# EAGLE design Qwiic_Spectral_Sensor-AS7265x-BottomJig (EAGLE 9.2.1)
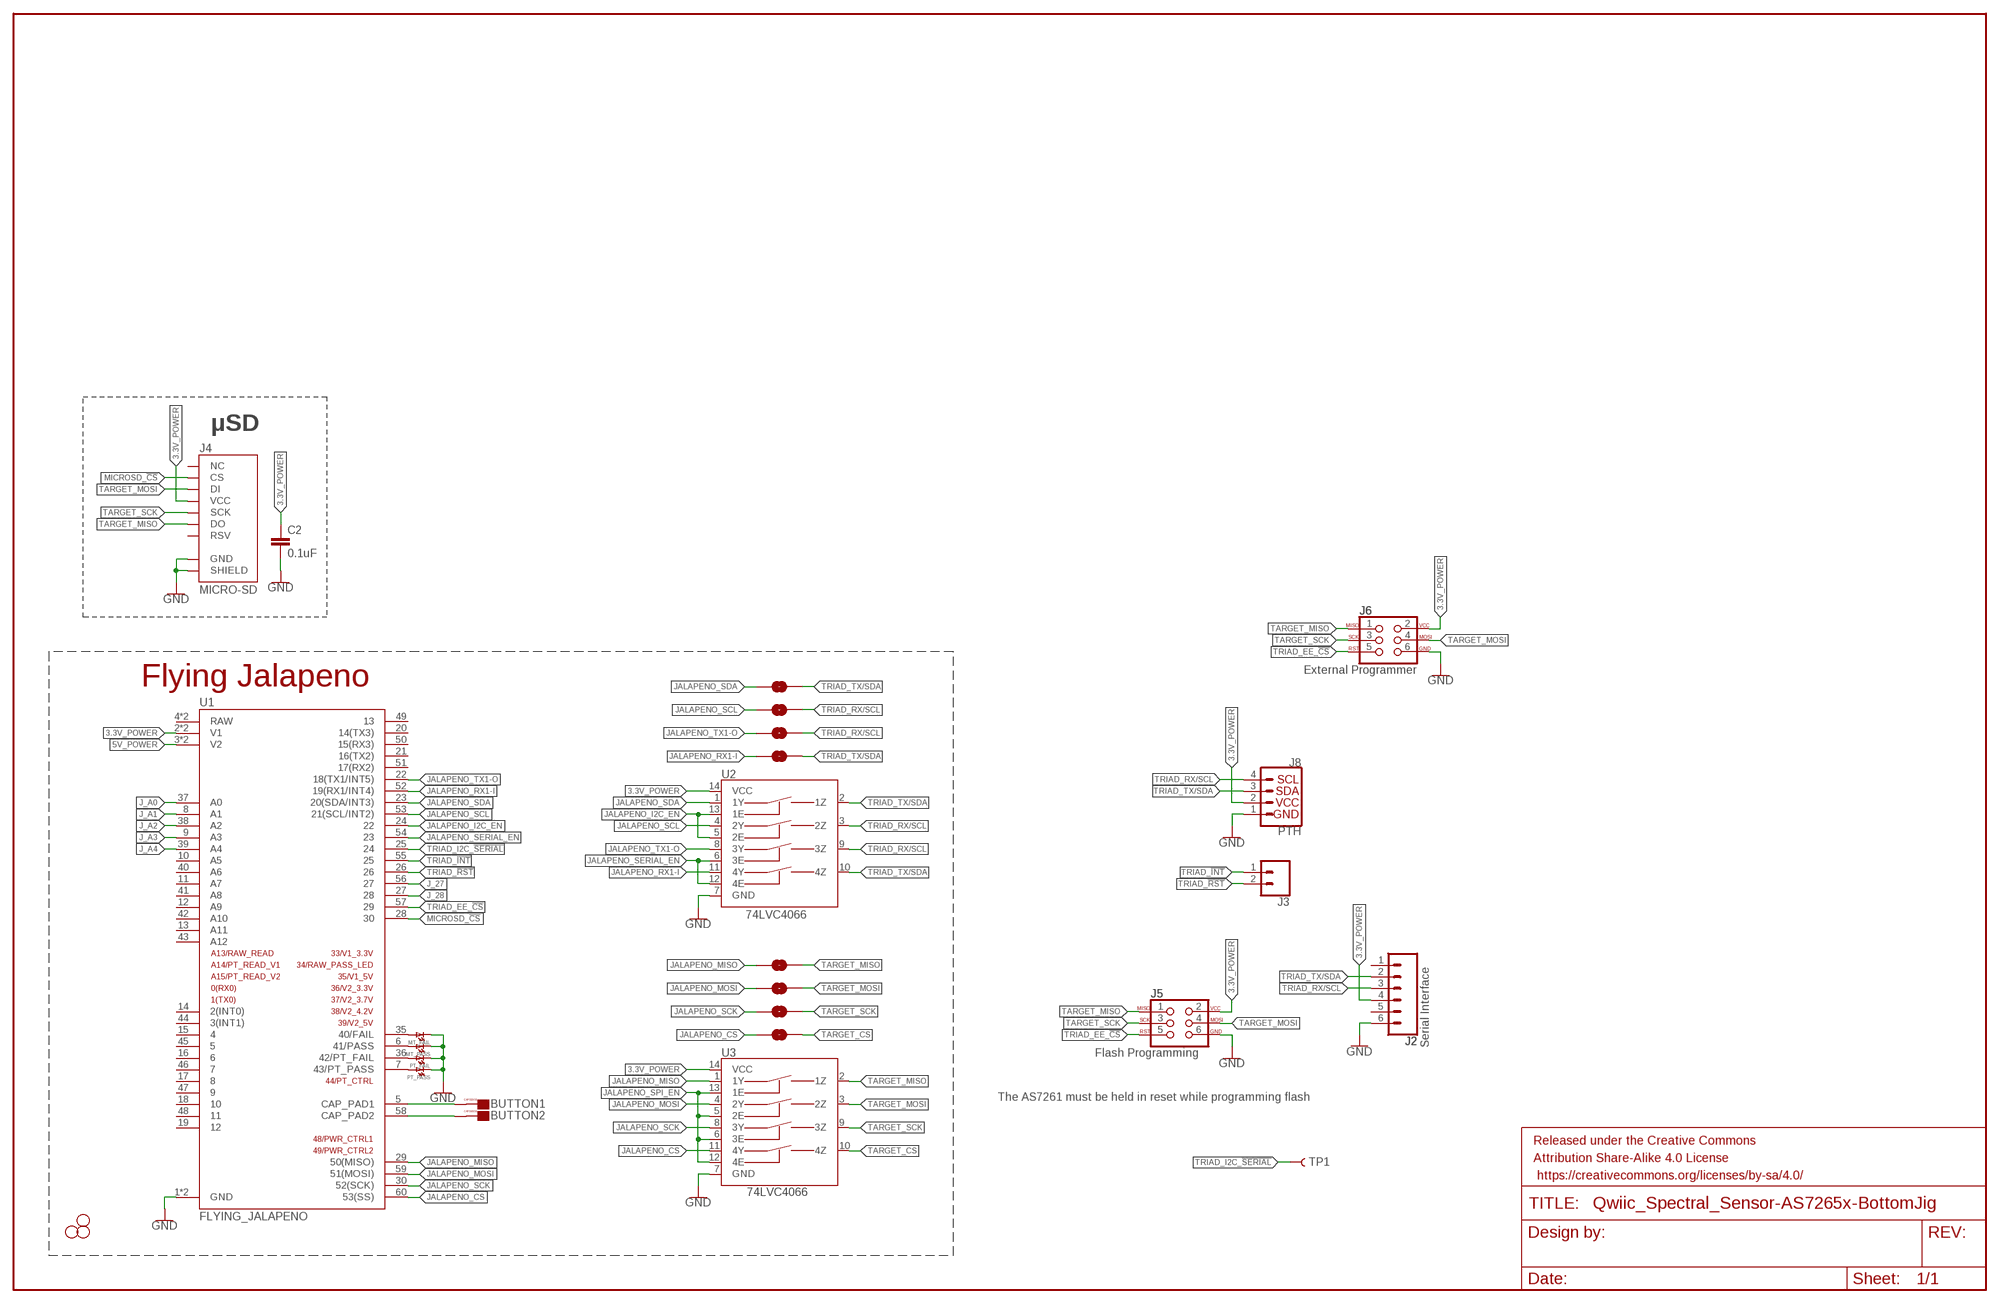
[diagram p0: schematic, sheet 1]

## Parts
BUTTON1  CAPSENSE_BUTTON_PAD_ONLY  [CAPSENSE_BUTTON_PADS_ONLY]
BUTTON2  CAPSENSE_BUTTON_PAD_ONLY  [CAPSENSE_BUTTON_PADS_ONLY]
C2  0.1uF  0.1UF-0603-25V-(+80/-20%)  [0603]
FRAME2  FRAME-LEDGER  [CREATIVE_COMMONS]
H1  STAND-OFF  [STAND-OFF]
H3  STAND-OFF  [STAND-OFF]
H4  STAND-OFF  [STAND-OFF]
J2  Serial Interface  CONN_06NO_SILK_FEMALE_PTH  [1X06_NO_SILK]
J3  CONN_021X02_NO_SILK  [1X02_NO_SILK]
J4  MICRO-SD  MICRO-SD_CARD_SOCKETPUSH-PUSH  [MICRO-SD-SOCKET]
J5  Flash Programming  AVR_SPI_PROG_3X2NS  [2X3-NS]
J6  External Programmer  AVR_SPI_PROG_3X2NS  [2X3-NS]
J8  PTH  I2C_STANDARD_NO_SILK  [1X04_NO_SILK]
J_SCL  JUMPER-SMT_2_NO_NO-SILK  [SMT-JUMPER_2_NO_NO-SILK]
J_SCL1  JUMPER-SMT_2_NO_NO-SILK  [SMT-JUMPER_2_NO_NO-SILK]
J_SCL2  JUMPER-SMT_2_NO_NO-SILK  [SMT-JUMPER_2_NO_NO-SILK]
J_SCL3  JUMPER-SMT_2_NO_NO-SILK  [SMT-JUMPER_2_NO_NO-SILK]
J_SCL4  JUMPER-SMT_2_NO_NO-SILK  [SMT-JUMPER_2_NO_NO-SILK]
J_SCL5  JUMPER-SMT_2_NO_NO-SILK  [SMT-JUMPER_2_NO_NO-SILK]
J_SDA  JUMPER-SMT_2_NO_NO-SILK  [SMT-JUMPER_2_NO_NO-SILK]
J_SDA1  JUMPER-SMT_2_NO_NO-SILK  [SMT-JUMPER_2_NO_NO-SILK]
MT_FAIL  LED1206  [LED-1206]
MT_PASS  LED1206  [LED-1206]
PT_FAIL  LED1206  [LED-1206]
PT_PASS  LED1206  [LED-1206]
TP1  TEST-POINTPOGO_PTH  [1X01_NO_SILK]
U1  FLYING_JALAPENO  FLYING_JALAPENO_V3MALE  [FLYING_JALAPENO_V3_M]
U2  74LVC4066  74LVC4066_MUX_1:1_X4  [SO14]
U3  74LVC4066  74LVC4066_MUX_1:1_X4  [SO14]

## Nets
3.3V_POWER [VCC]: C2.1 J2.4 J4.VCC J5.2 J6.2 J8.2 U1.2(V1) U1.32(V1) U2.14(VCC) U3.14(VCC)
5V_POWER [POWA]: U1.3(V2) U1.33(V2)
BUTTON1 [CAPSENSE]: BUTTON1.CAPSENSE_PAD(CAPSENSE) U1.5(CAP_PAD1)
BUTTON2 [CAPSENSE]: BUTTON2.CAPSENSE_PAD(CAPSENSE) U1.58(CAP_PAD2)
GND: C2.2 J2.6 J4.CD1(SHIELD) J4.GND J5.6 J6.6 J8.1 MT_FAIL.C MT_PASS.C PT_FAIL.C PT_PASS.C U1.1(GND) U1.31(GND) U2.7(GND) U3.7(GND)
J_27: U1.56
J_28: U1.27
J_A0: U1.37(A0)
J_A1: U1.8(A1)
J_A2: U1.38(A2)
J_A3: U1.9(A3)
J_A4: U1.39(A4)
JALAPENO_CS: J_SDA1.1 U1.60(53(SS)) U3.11(4Y)
JALAPENO_I2C_EN: U1.24 U2.5(2E) U2.13(1E)
JALAPENO_MISO: J_SCL5.1 U1.29(50(MISO)) U3.1(1Y)
JALAPENO_MOSI: J_SCL3.1 U1.59(51(MOSI)) U3.4(2Y)
JALAPENO_RX1-I: J_SDA.1 U1.52(19(RX1/INT4)) U2.11(4Y)
JALAPENO_SCK: J_SCL4.1 U1.30(52(SCK)) U3.8(3Y)
JALAPENO_SCL: J_SCL.1 U1.53(21(SCL/INT2)) U2.4(2Y)
JALAPENO_SDA: J_SCL2.1 U1.23(20(SDA/INT3)) U2.1(1Y)
JALAPENO_SERIAL_EN: U1.54 U2.6(3E) U2.12(4E)
JALAPENO_SPI_EN: U3.5(2E) U3.6(3E) U3.12(4E) U3.13(1E)
JALAPENO_TX1-O: J_SCL1.1 U1.22(18(TX1/INT5)) U2.8(3Y)
MICROSD_!CS!: J4.CS U1.28
N$10: PT_PASS.A U1.7(43/PT_PASS)
N$14: PT_FAIL.A U1.36(42/PT_FAIL)
N$15: MT_PASS.A U1.6(41/PASS)
N$16: MT_FAIL.A U1.35(40/FAIL)
TARGET_CS: J_SDA1.2 U3.10(4Z)
TARGET_MISO: J4.DO J5.1 J6.1 J_SCL5.2 U3.2(1Z)
TARGET_MOSI: J4.DI J5.4 J6.4 J_SCL3.2 U3.3(2Z)
TARGET_SCK: J4.SCLK(SCK) J5.3 J6.3 J_SCL4.2 U3.9(3Z)
TRIAD_!INT!: J3.1 U1.55
TRIAD_!RST!: J3.2 U1.26
TRIAD_EE_!CS!: J5.5 J6.5 U1.57
TRIAD_I2C_!SERIAL!: TP1.1 U1.25
TRIAD_RX/SCL: J2.3 J8.4 J_SCL1.2 J_SCL.2 U2.3(2Z) U2.9(3Z)
TRIAD_TX/SDA: J2.2 J8.3 J_SCL2.2 J_SDA.2 U2.2(1Z) U2.10(4Z)
Unconnected: J2.1 J2.5 J4.RSV1(RSV) J4.RSV2(NC) U1.4(RAW) U1.10(A5) U1.11(A7) U1.12(A9) U1.13(A11) U1.14(2(INT0)) U1.15 U1.16 U1.17 U1.18 U1.19 U1.20(14(TX3)) U1.21(16(TX2)) U1.34(RAW) U1.40(A6) U1.41(A8) U1.42(A10) U1.43(A12) U1.44(3(INT1)) U1.45 U1.46 U1.47 U1.48 U1.49 U1.50(15(RX3)) U1.51(17(RX2))

## Notes on the sheet
- μSD
- Flying Jalapeno
- The AS7261 must be held in reset while programming flash

## Library data of the parts
BUTTON1 BUTTON2 = Testing:CAPSENSE_BUTTON_PAD_ONLY
C2 = SparkFun-Capacitors:0.1UF: 0.1µF ceramic capacitors A capacitor is a passive two-terminal electrical component used to store electrical energy temporarily in an electric field.; PROD_ID: CAP-00810
FRAME2 = SparkFun-Aesthetics:FRAME-LEDGER: Schematic Frame - Ledger Standard 11x14 US Ledger frame
H1 H3 H4 = SparkFun-Hardware:STAND-OFF: Stand Off Drill holes for mechanically mounting via screws, standoffs, etc. Note: Use the keepout ring to avoid running the screw head into surrounding components. Variant Overviews STAND-OFF - Mechanical footprint for a #4 phillips button head screw. STAND-OFF-TIGHT - Mechanical footprint for a #4 phillips button head screw, Example SparkFun Products Screw - Phillips Head (1/4", 4-40, 10 pack) <https://www.sparkfun.com/products/10453> (PRT-10453) Screw - Phillips Head (1/2", 4-40, 10 pack) <https://www.sparkfun.com/products/10452> (PRT-10452) Screw - Phillips Head (3/4", 4-40, 10 pack) <https://www.sparkfun.com/products/10451> (PRT-10451) Screw - Phillips Head (1", 4-40, 10 pack) <https://www.sparkfun.com/products/10450> (PRT-10450)
J2 = SparkFun-Connectors:CONN_06: Multi connection point. Often used as Generic Header-pin footprint for 0.1 inch spaced/style header connections On any of the 0.1 inch spaced packages, you can populate with these: Break Away Headers - Straight <https://www.sparkfun.com/products/116> (PRT-00116) Break Away Male Headers - Right Angle <https://www.sparkfun.com/products/553> (PRT-00553) Female Headers <https://www.sparkfun.com/products/115> (PRT-00115) Break Away Headers - Machine Pin <https://www.sparkfun.com/products/117> (PRT-00117) Break Away Female Headers - Swiss Machine Pin <https://www.sparkfun.com/products/743> (PRT-00743) Arduino Stackable Header - 6 Pin <https://www.sparkfun.com/products/9280> (PRT-09280) For SCREWTERMINALS and SPRING TERMINALS visit here: Screw Terimnals on SparkFun.com <https://www.sparkfun.com/search/results?term=Screw+Terminals> (5mm/3.5mm/2.54mm spacing) This device is also useful as a general connection point to wire up your design to another part of your project. Our various solder wires solder well into these plated through hole pads. Hook-Up Wire - Assortment (Stranded, 22 AWG) <https://www.sparkfun.com/products/11375> (PRT-11375) Hook-Up Wire - Assortment (Solid Core, 22 AWG) <https://www.sparkfun.com/products/11367> (PRT-11367) View the entire wire category on our website here <https://www.sparkfun.com/categories/141>; PROD_ID: CONN-08437
J3 = SparkFun-Connectors:CONN_02: Multi connection point. Often used as Generic Header-pin footprint for 0.1 inch spaced/style header connections On any of the 0.1 inch spaced packages, you can populate with these: Break Away Headers - Straight <https://www.sparkfun.com/products/116> (PRT-00116) Break Away Male Headers - Right Angle <https://www.sparkfun.com/products/553> (PRT-00553) Female Headers <https://www.sparkfun.com/products/115> (PRT-00115) Break Away Headers - Machine Pin <https://www.sparkfun.com/products/117> (PRT-00117) Break Away Female Headers - Swiss Machine Pin <https://www.sparkfun.com/products/743> (PRT-00743) For SCREWTERMINALS and SPRING TERMINALS visit here: Screw Terimnals on SparkFun.com <https://www.sparkfun.com/search/results?term=Screw+Terminals> (5mm/3.5mm/2.54mm spacing) This device is also useful as a general connection point to wire up your design to another part of your project. Our various solder wires solder well into these plated through hole pads. Hook-Up Wire - Assortment (Stranded, 22 AWG) <https://www.sparkfun.com/products/11375> (PRT-11375) Hook-Up Wire - Assortment (Solid Core, 22 AWG) <https://www.sparkfun.com/products/11367> (PRT-11367) View the entire wire category on our website here <https://www.sparkfun.com/categories/141> Special notes: Molex polarized connector foot print use with: PRT-08233 with associated crimp pins and housings. 2.54_SCREWTERM for use with PRT-10571. 3.5mm Screw Terminal footprints for PRT-08084 5mm Screw Terminal footprints for use with PRT-08432
J4 = SparkFun-Connectors:MICRO-SD_CARD_SOCKET: microSD Socket for Transflash Push-push type µSD socket. tDoc lines correctly indicate media card edge positions when inserting (unlocked, locked, depressed). NOTE: CD1 and CD2 are connected internally, and the default detect state of the socket is detect pin to ground. SparkFun Products: WAV Trigger <https://www.sparkfun.com/products/13660> CAN-Bus Shield <https://www.sparkfun.com/products/13262> SparkFun Level Shifing microSD Breakout <https://www.sparkfun.com/products/13743>; PROD_ID: CONN-07820
J5 J6 = SparkFun-Connectors:AVR_SPI_PROG_3X2: AVR ISP 6 Pin This is the reduced ISP connector for AVR programming. Common on Arduino. This footprint will take up less PCB space and can be used with a 10-pin to 6-pin adapter such as SKU: BOB-08508 **Special note about "TEST_POINT" package. The stop mask is on the top side, so if you want your programming test points to be on the bottom of your board, make sure to place this package on the bottom side of the board. This also ensure that the orientation to program from the bottom side will be correct. SparkFun Products: SparkFun ISP Pogo Adapter <https://www.sparkfun.com/products/11591> - NS Tiny AVR Programmer <https://www.sparkfun.com/products/11801> -PTH
J8 = SparkFun-Connectors:I2C_STANDARD: SparkFun I2C Standard Pinout Header SparkFun has standardized on a pinout for all I2C based sensor breakouts. This pinout allows I2C boards to be plugged directly into the headers on Arduino Uno compatible boards, and to be daisy chained easily. Example SparkFun Products: SparkFun Atmospheric Sensor Breakout - BME280 <https://www.sparkfun.com/products/13676> SparkFun Altitude/Pressure Sensor Breakout - MPL3115A2 <https://www.sparkfun.com/products/11084> SparkFun TOF Range Finder Sensor - VL6180 <https://www.sparkfun.com/products/12785>
J_SCL J_SCL1-J_SCL5 J_SDA J_SDA1 = SparkFun-Jumpers:JUMPER-SMT_2_NO: Normally open jumper This jumper has two pads in close proximity to each other. Apply solder to close the connection. Round pads are easier to solder for beginners, but are a lot larger. SparkFun Product that uses the round pads: SparkFun EL Sequencer <https://www.sparkfun.com/products/12781>
MT_FAIL MT_PASS PT_FAIL PT_PASS = Testing:LED: LEDs Standard schematic elements and footprints for 5mm, 3mm, 1206, and 0603 sized LEDs. 5mm - Spark Fun Electronics SKU : COM-00529 (and others)
TP1 = SparkFun-Connectors:TEST-POINT: SparkFun Test Points Bare copper test points for troubleshooting or In-Circuit-Testing. These are used by our Production team for verifying production board runs using pogo-pins on test beds. SparkFun Products: SparkFun LSM9DS1 Breakout <https://www.sparkfun.com/products/13284> SparkFun PSOC <https://www.sparkfun.com/products/13714> SparkFun Load Cell Amplifier <https://www.sparkfun.com/products/13879>
U1 = Testing:FLYING_JALAPENO_V3
U2 U3 = Testing:74LVC4066_MUX_1:1_X4

## Net classes
1 VCC: width 0.381 mm
2 POWA: width 0.61 mm
3 CAPSENSE: width 0.508 mm

## Board
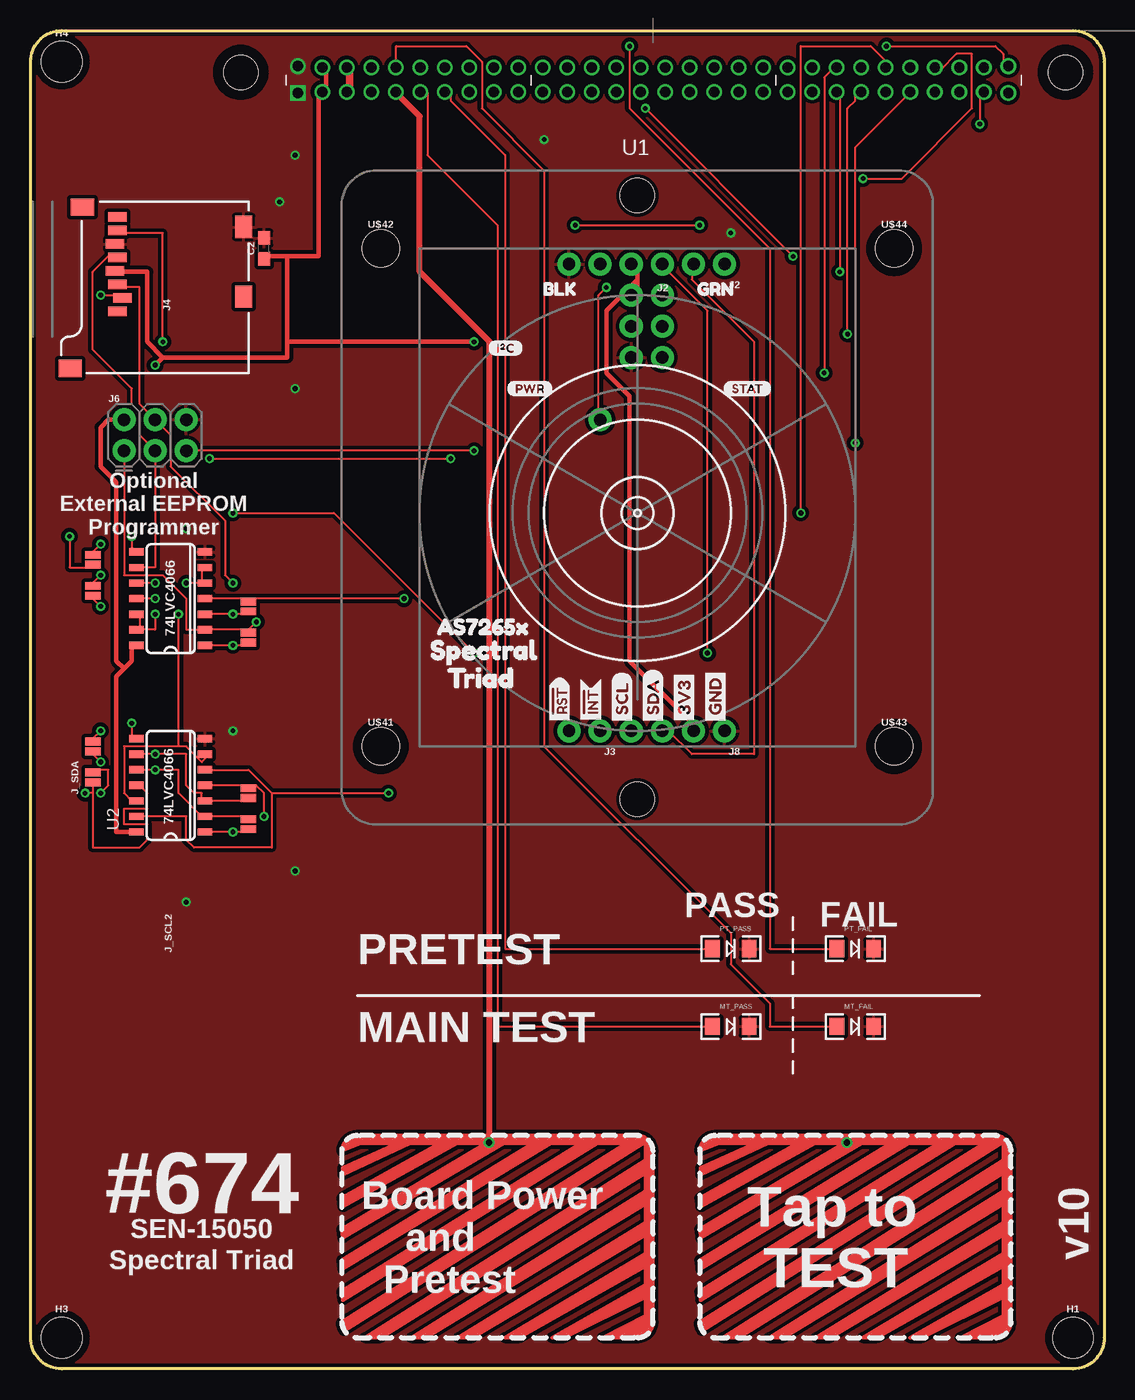
[diagram p1: board, top side]
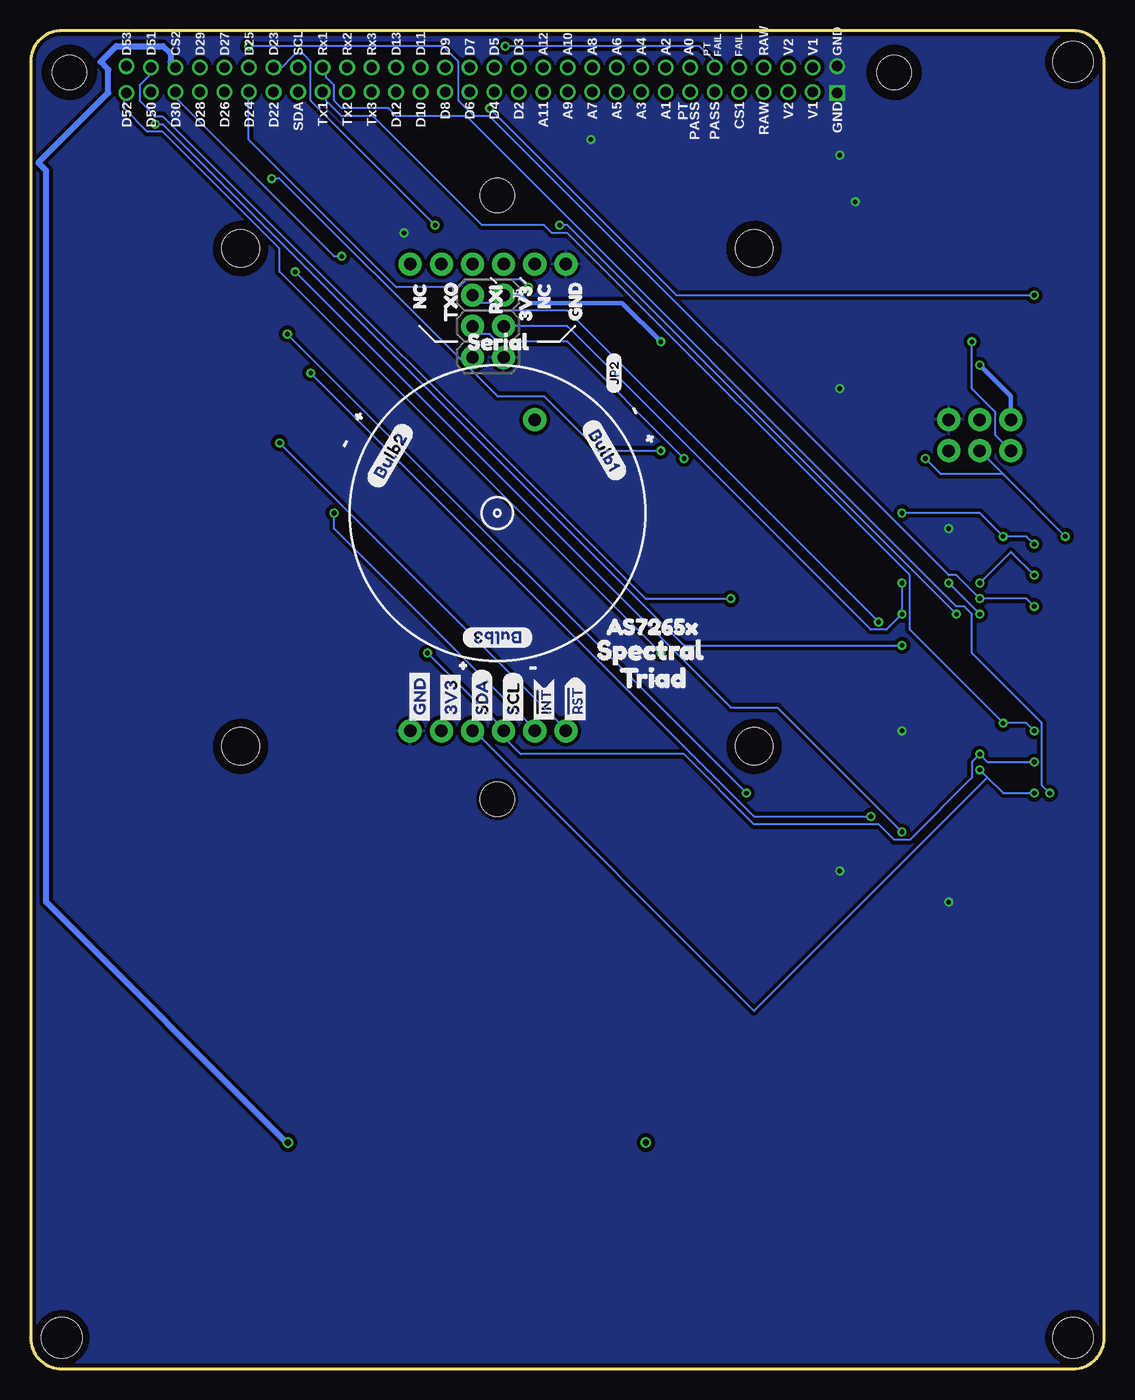
[diagram p2: board, bottom side, seen from below]

Size 87.63 x 109.22 mm. Coordinates in mm from the lower left corner, seen from the top.
Outline: 2.54,109.22 85.09,109.22 arc-90 87.63,106.68 87.63,2.54 arc-90 85.09,0 2.54,0 arc-90 0,2.54 0,106.68 arc-90 2.54,109.22
Copper layers (1*16): Top 0.035mm / dielectric 1.5mm / Bottom 0.035mm
Design rules "SparkFun-2-layer-TIGHT": minimum track width 7mil, minimum drill 15mil, track to track 7mil, track to pad 7mil, pad to pad 7mil, via to via 7mil, smd to smd 7mil, copper to edge 7mil, drill to drill 7mil, minimum pad ring 7mil, minimum via ring 7mil, stop-mask expansion 4mil, vias tented up to drill 25mil, thermal gap 10mil

### Footprints (pad centres in the part's own frame; a part is rotated, then mirrored left to right if it is on the bottom)
CAPSENSE_BUTTON_PADS_ONLY = drill 0.508: CAPSENSE_PAD -0.686,7.036
0603 = smd 1.1 x 1: 1 -0.85,0; 2 0.85,0
STAND-OFF = hole 3.302: 0,0
1X06_NO_SILK = drill 1.016 pad 1.88: 1 0,0; 2 2.54,0; 3 5.08,0; 4 7.62,0; 5 10.16,0; 6 12.7,0
1X02_NO_SILK = drill 1.016 pad 1.88: 1 0,0; 2 2.54,0
MICRO-SD-SOCKET = smd 1.8 x 1.4: CD1 -2.05,0.4; CD2 -7.75,0.4 | smd 0.8 x 1.5: CS -7.84,10.3; DI -6.74,10.7; DO -2.34,10.7; GND -3.44,10.9; RSV1 -8.94,10.7; RSV2 -1.24,10.7; SCLK -4.54,10.7; VCC -5.64,10.9 | smd 1.4 x 1.9: GND1 -13.6,14.55; GND3 -0.45,13.55
2X3-NS = drill 1.016 pad 1.88: 1 -2.54,-1.27; 2 -2.54,1.27; 3 0,-1.27; 4 0,1.27; 5 2.54,-1.27; 6 2.54,1.27
1X04_NO_SILK = drill 1.016 pad 1.88: 1 0,0; 2 2.54,0; 3 5.08,0; 4 7.62,0
SMT-JUMPER_2_NO_NO-SILK = smd 0.635 x 1.27: 1 -0.406,0; 2 0.406,0
LED-1206 = smd 1.2 x 1.4: A -1.5,0; C 1.5,0
1X01_NO_SILK = drill 1.016 pad 1.88: 1 0,0
FLYING_JALAPENO_V3_M = drill 0.85 square: 1 -29,-5.1 | drill 0.85: 2 -27,-5; 3 -25,-5; 4 -23,-5; 5 -21,-5; 6 -19,-5; 7 -17,-5; 8 -15,-5; 9 -13,-5; 10 -11,-5; 11 -9,-5; 12 -7,-5; 13 -5,-5; 14 -3,-5; 15 -1,-5; 16 1,-5; 17 3,-5; 18 5,-5; 19 7,-5; 20 9,-5; 21 11,-5; 22 13,-5; 23 15,-5; 24 17,-5; 25 19,-5; 26 21,-5; 27 23,-5; 28 25,-5; 29 27,-5; 30 29,-5.1; 31 -29,-2.9; 32 -27,-3; 33 -25,-3; 34 -23,-3; 35 -21,-3; 36 -19,-3; 37 -17,-3; 38 -15,-3; 39 -13,-3; 40 -11,-3; 41 -9,-3; 42 -7,-3; 43 -5,-3; 44 -3,-3; 45 -1,-3; 46 1,-3; 47 3,-3; 48 5,-3; 49 7,-3; 50 9,-3; 51 11,-3; 52 13,-3; 53 15,-3; 54 17,-3; 55 19,-3; 56 21,-3; 57 23,-3; 58 25,-3; 59 27,-3; 60 29,-2.9 | hole 2.794: 33.655,-3.404; -33.655,-3.404
SO14 = smd 0.6 x 1.2: 1 -3.175,-2.8; 2 -1.905,-2.8; 3 -0.635,-2.8; 4 0.635,-2.8; 5 1.905,-2.8; 6 3.175,-2.8; 7 4.445,-2.8; 8 4.445,2.8; 9 3.175,2.8; 10 1.905,2.8; 11 0.635,2.8; 12 -0.635,2.8; 13 -1.905,2.8; 14 -3.175,2.8
STAND-OFF-TIGHT = hole 3.048: 0,0
NUBBIN_LOCKER = hole 2.794: 0,0

### Placement (x,y rotation side)
BUTTON1  38.1,11.43 0 top
BUTTON2  67.31,11.43 0 top
C2  19.05,91.44 90 top
FRAME2  11.43,-11.43 0 top  (outside the outline)
H1  85.09,2.54 0 top
H3  2.54,2.54 0 top
H4  2.54,106.68 0 top
J2  56.64,90.17 180 top
J3  46.48,52.07 180 top
J4  17.78,95.25 90 top
J5  50.29,85.09 270 bottom
J6  10.16,76.2 0 top
J8  56.64,52.07 180 top
J_SCL  17.78,46.99 270 top
J_SCL1  5.08,50.8 270 top
J_SCL2  17.78,44.45 90 top
J_SCL3  17.78,62.23 270 top
J_SCL4  5.08,66.04 270 top
J_SCL5  17.78,59.69 90 top
J_SDA  5.08,48.26 90 top
J_SDA1  5.08,63.5 90 top
MT_FAIL  67.31,27.94 0 top
MT_PASS  57.15,27.94 0 top
PT_FAIL  67.31,34.29 0 top
PT_PASS  57.15,34.29 0 top
TP1  46.48,77.47 0 bottom
U1  50.8,109.22 0 top
U2  11.43,46.99 90 top
U3  11.43,62.23 90 top
U$1  [#0]  61.59,76.71 60 bottom
U$2  [I_SUPER2_C-()-03]  37.34,83.31 0 top
U$3  [PWR-()-03]  38.86,80.01 0 top
U$4  [AS7265X0]  32,60.58 0 top
U$5  [BULB15]  42.16,77.34 300 bottom
U$6  [BULB26]  59.82,71.88 60 bottom
U$7  [BULB37]  46.61,59.69 180 bottom
U$8  [JP20]  40.01,79.63 90 bottom
U$9  [SPECTRAL1]  31.24,58.67 0 top
U$10  [STAT4]  56.52,80.01 0 top
U$11  [TRIAD2]  32.64,56.39 0 top
U$12  [TRIAD2]  40.89,56.39 0 bottom
U$13  [SPECTRAL1]  42.8,58.67 0 bottom
U$14  [AS7265X0]  41.78,60.58 0 bottom
U$15  [3V33]  47.24,84.45 90 bottom
U$16  [BLK7]  40.89,88.14 0 top
U$17  [GND5]  43.18,84.71 90 bottom
U$18  [GRN6]  53.34,88.14 0 top
U$19  [NC4]  55.88,85.6 90 bottom
U$20  [NC4]  45.72,85.6 90 bottom
U$21  [RXI2]  49.66,85.22 90 bottom
U$22  [SERIAL0]  53.09,83.82 0 bottom
U$23  [TXO1]  53.34,84.58 90 bottom
U$24  [3V3-04]  53.34,52.45 90 bottom
U$25  [GND-04]  55.88,52.45 90 bottom
U$26  [SDA-[)]  50.8,52.45 90 bottom
U$27  [SCL-[)]  48.26,52.45 90 bottom
U$28  [INT#-[<-04]  45.72,52.32 90 bottom
U$29  [RST#-[>-04]  43.18,52.32 90 bottom
U$30  [GND-04]  55.88,52.45 90 top
U$31  [3V3-04]  53.34,52.45 90 top
U$32  [SDA-[)]  50.8,52.45 90 top
U$33  [SCL-[)]  48.26,52.45 90 top
U$34  [INT#-[<-04]  45.72,52.32 90 top
U$35  [RST#-[>-04]  43.18,52.32 90 top
U$36  [#0]  37.59,77.09 300 bottom
U$37  [#0]  53.59,57.53 0 bottom
U$38  [#1]  47.88,57.4 0 bottom
U$39  [#1]  38.73,79.38 300 bottom
U$40  [#1]  62.74,74.55 60 bottom
U$41  [STAND-OFF-TIGHT]  28.58,50.8 0 top
U$42  [STAND-OFF-TIGHT]  28.58,91.44 0 top
U$43  [STAND-OFF-TIGHT]  70.48,50.8 0 top
U$44  [STAND-OFF-TIGHT]  70.48,91.44 0 top
U$45  [NUBBIN_LOCKER]  49.53,46.48 0 top
U$46  [NUBBIN_LOCKER]  49.53,95.76 0 top

### Tracks (layer width: path | path; a pad name or v marks a point on that pad's centre or on a via)
3.3V_POWER  (via drill 0.38)
  Top 0.381: 49.53,88.9 49.53,89.53 J2.4 | 49.53,88.9 49.53,87.63 J5.2 | 49.53,88.9 46.99,86.36 46.99,81.28 48.9,79.38 48.9,57.78 53.98,52.7 J8.2 | U2.14 6.99,43.81 6.99,56.52 7.62,57.15 | 7.62,57.15 8.26,57.78 8.26,59.05 U3.14 | 20.95,90.81 23.5,90.81 23.5,104.14 U1.2 24.13,104.78 24.13,106.05 U1.32 | 20.95,90.81 19.05,90.81 C2.1 | 10.79,82.55 9.53,83.82 9.53,89.53 6.99,89.53 J4.VCC | 10.79,82.55 20.95,82.55 20.95,83.82 | 20.95,90.81 20.95,83.82 | 10.79,82.55 v10.16,81.92 | 7.62,57.15 6.99,57.78 6.99,72.39 5.71,73.66 5.71,76.83 6.35,77.47 J6.2 | 20.95,83.82 v36.2,83.82
  Bottom 0.381: J6.2 7.62,79.38 v10.16,81.92 | v36.2,83.82 39.37,87 46.99,87 47.62,87.63 48.9,87.63 J5.2
5V_POWER
  Top 0.61: U1.3 26.04,104.78 26.04,106.05 U1.33
BUTTON1
  Top 0.508: U1.5 29.84,104.14 31.75,102.23 31.75,89.53 37.47,83.82 37.47,18.41 BUTTON1.CAPSENSE_PAD
BUTTON2
  Bottom 0.508: U1.58 76.2,106.68 76.2,107.31 76.83,107.95 80.64,107.95 81.92,106.68 81.28,106.05 81.28,104.14 87,98.42 86.36,97.79 86.36,38.1 66.67,18.41 BUTTON2.CAPSENSE_PAD
GND  (via drill 0.38)
  other vias: 12.7,68.58 20.32,95.25 16.51,52.07 21.59,40.64 12.7,38.1 21.59,80.01 57.15,92.71 41.91,100.33 21.59,99.06
  pour Top (isolate 0.305): 0,109.22 87.63,109.22 87.63,0 0,0
  pour Bottom (isolate 0.305): 0,109.22 87.63,109.22 87.63,0 0,0
JALAPENO_CS  (via drill 0.38)
  Top 0.178: v10.16,62.87 U3.11 | v5.71,62.23 5.08,62.87 J_SDA1.1 | v69.85,107.95 78.74,107.95 79.38,107.31 79.38,106.68 U1.60
  Bottom 0.178: v5.71,62.23 6.35,62.87 v10.16,62.87 12.06,64.77 12.7,64.77 50.16,102.23 51.44,102.23 52.7,103.5 52.7,106.68 53.98,107.95 v69.85,107.95
JALAPENO_I2C_EN  (via drill 0.38)
  Top 0.178: U2.13 12.7,45.09 12.7,43.18 13.34,42.55 19.68,42.55 19.68,46.99 | 19.68,46.99 17.78,48.9 U2.5 | v66.67,84.45 66.67,102.87 67.31,103.5 67.31,104.14 U1.24 | 19.68,46.99 v29.21,46.99
  Bottom 0.178: v29.21,46.99 v66.67,84.45
JALAPENO_MISO  (via drill 0.38)
  Top 0.178: U3.1 v16.51,59.05 17.78,59.05 J_SCL5.1 | v77.47,101.6 77.47,104.14 U1.29
  Bottom 0.178: v16.51,59.05 34.29,59.05 76.83,101.6 v77.47,101.6
JALAPENO_MOSI  (via drill 0.38)
  Top 0.178: 17.78,62.87 U3.4 | v30.48,62.87 17.78,62.87 | 17.78,62.87 J_SCL3.1
  Bottom 0.178: v30.48,62.87 37.47,62.87 76.83,102.23 77.47,102.23 78.74,103.5 78.74,104.78 77.47,106.05 U1.59
JALAPENO_RX1-I  (via drill 0.38)
  Top 0.178: J_SDA.1 5.08,46.99 | 5.08,46.99 5.08,42.55 8.89,42.55 9.53,43.18 9.53,44.45 7.62,44.45 7.62,45.72 9.53,45.72 9.53,46.99 8.89,47.62 U2.11 | 5.08,46.99 v4.45,46.99
  Bottom 0.178: v4.45,46.99 5.08,47.62 5.08,52.7 10.79,58.42 10.79,61.59 11.43,62.23 12.06,62.23 52.07,102.23 57.78,102.23 58.42,102.87 62.23,102.87 62.87,103.5 62.87,104.78 63.5,105.41 63.5,106.05 U1.52
JALAPENO_SCK  (via drill 0.38)
  Top 0.178: v8.26,67.94 8.26,66.67 U3.8 | v5.71,67.31 5.08,66.67 J_SCL4.1 | v36.2,58.42 24.77,69.85 v16.51,69.85
  Bottom 0.178: v5.71,67.31 6.35,67.94 v8.26,67.94 10.16,69.85 v16.51,69.85 | v36.2,58.42 67.31,89.53 67.31,91.44 76.83,100.97 78.11,100.97 80.01,102.87 80.01,103.5 U1.30
JALAPENO_SCL  (via drill 0.38)
  Top 0.178: 17.78,47.62 U2.4 | 17.78,47.62 18.41,47.62 19.05,46.99 v19.05,45.09 | v64.77,81.28 64.77,105.41 65.41,106.05 U1.53 | 17.78,47.62 J_SCL.1
  Bottom 0.178: v19.05,45.09 28.57,45.09 v64.77,81.28
JALAPENO_SDA  (via drill 0.38)
  Top 0.178: U2.1 v16.51,43.81 17.78,43.81 J_SCL2.1 | v66.04,89.53 66.04,104.14 U1.23
  Bottom 0.178: v16.51,43.81 26.67,53.98 30.48,53.98 v66.04,89.53
JALAPENO_SERIAL_EN  (via drill 0.38)
  Top 0.178: 12.06,50.8 12.7,50.8 13.97,49.53 14.61,50.16 U2.6 | 12.06,50.8 7.62,50.8 7.62,46.99 8.26,46.35 U2.12 | v44.45,93.34 v54.61,93.34 | 12.06,50.8 v12.06,61.59
  Bottom 0.178: v54.61,93.34 64.77,103.5 64.77,106.68 65.41,107.31 66.04,107.31 67.31,106.05 U1.54 | v44.45,93.34 43.81,93.34 v12.06,61.59
JALAPENO_SPI_EN  (via drill 0.38)
  Top 0.178: 8.89,60.33 8.89,61.59 U3.12 | 13.97,64.14 13.97,65.41 U3.6 | 8.89,60.33 10.16,60.33 v10.16,61.59 | 13.97,64.14 v12.7,64.14 | 8.89,60.33 U3.13 | 13.97,64.14 U3.5
  Bottom 0.178: v12.7,64.14 v10.16,61.59
JALAPENO_TX1-O  (via drill 0.38)
  Top 0.178: v8.26,52.7 8.26,51.44 U2.8 | v5.71,52.07 5.08,51.44 J_SCL1.1
  Bottom 0.178: v5.71,52.07 6.35,52.7 v8.26,52.7 15.88,60.33 15.88,64.77 43.81,92.71 45.09,92.71 45.72,93.34 50.8,93.34 59.69,102.23 62.23,102.23 63.5,103.5 63.5,104.14 U1.22
MICROSD_!CS!  (via drill 0.38)
  Top 0.178: v5.71,87.63 6.99,87.63 J4.CS | v62.23,90.81 v50.16,102.87
  Bottom 0.178: v5.71,87.63 34.92,87.63 v50.16,102.87 | v62.23,90.81 62.87,90.81 76.2,104.14 U1.28
N$10
  Top 0.178: PT_PASS.A 38.73,34.29 38.73,99.06 34.29,103.5 34.29,104.14 U1.7
N$14  (via drill 0.38)
  Top 0.178: PT_FAIL.A 60.33,34.29 60.33,91.44 48.9,102.87 v48.9,107.95
  Bottom 0.178: v48.9,107.95 33.02,107.95 31.75,106.68 U1.36
N$15
  Top 0.178: MT_PASS.A 38.1,27.94 38.1,93.34 32.38,99.06 32.38,104.14 U1.6
N$16
  Top 0.178: MT_FAIL.A 60.33,27.94 60.33,29.84 57.15,33.02 57.15,35.56 41.91,50.8 41.91,97.79 36.83,102.87 36.83,106.68 35.56,107.95 29.84,107.95 29.84,106.68 U1.35
TARGET_CS  (via drill 0.38)
  Top 0.178: v10.16,64.14 U3.10 | v5.71,64.77 5.08,64.14 J_SDA1.2
  Bottom 0.178: v10.16,64.14 7.62,66.67 v5.71,64.77
TARGET_MISO  (via drill 0.38)
  Top 0.178: 17.78,60.33 U3.2 12.7,60.33 12.7,62.87 10.79,64.77 7.62,64.77 J6.1 | v10.79,83.82 10.79,92.71 7.62,92.71 J4.DO | 17.78,60.33 v18.41,60.96 | 17.78,60.33 J_SCL5.2
  Bottom 0.178: v10.79,83.82 10.79,80.01 8.89,78.11 8.89,76.2 J6.1 | v18.41,60.96 43.81,86.36 49.53,86.36 50.16,87 51.44,87 J5.1
TARGET_MOSI  (via drill 0.38)
  Top 0.178: U3.3 v16.51,61.59 17.78,61.59 J_SCL3.2 | J4.DI 7.62,88.27 8.89,88.27 8.89,78.74 J6.4 11.43,76.2 11.43,73.66 15.88,69.22 15.88,64.77 v16.51,64.14
  Bottom 0.178: v16.51,64.14 v16.51,61.59 17.78,60.33 19.05,60.33 43.81,85.09 48.9,85.09 J5.4
TARGET_SCK  (via drill 0.38)
  Top 0.178: U3.9 10.16,65.41 J6.3 8.89,76.2 8.89,78.11 8.26,78.74 8.26,80.01 5.08,83.19 5.08,89.53 6.35,90.81 6.99,90.81 J4.SCLK | v3.17,67.94 3.17,65.41 5.08,65.41 J_SCL4.2 | v14.61,74.3 v34.29,74.3
  Bottom 0.178: J6.3 8.26,73.03 | 8.26,73.03 v3.17,67.94 | v34.29,74.3 43.81,83.82 49.53,83.82 50.16,84.45 51.44,84.45 J5.3 | v14.61,74.3 13.34,73.03 8.26,73.03
TRIAD_!INT!  (via drill 0.38)
  Top 0.178: v62.87,69.85 62.87,107.95 68.58,107.95 69.85,106.68 U1.55
  Bottom 0.178: v62.87,69.85 62.87,68.58 46.99,52.7 J3.1
TRIAD_!RST!  (via drill 0.38)
  Top 0.178: v67.31,75.56 67.31,99.69 71.75,104.14 U1.26
  Bottom 0.178: v67.31,75.56 44.45,52.7 J3.2
TRIAD_EE_!CS!  (via drill 0.38)
  Top 0.178: v67.94,97.16 71.12,97.16 76.83,102.87 76.83,107.31 75.56,107.31 74.3,106.05 U1.57 | v36.2,74.93 J6.5
  Bottom 0.178: v67.94,97.16 67.31,97.16 52.07,81.92 | v36.2,74.93 41.27,74.93 45.72,79.38 49.53,79.38 52.07,81.92 | 52.07,81.92 J5.5
TRIAD_I2C_!SERIAL!  (via drill 0.38)
  Top 0.178: v46.99,88.27 46.35,87.63 46.35,77.47 TP1.1
  Bottom 0.178: v46.99,88.27 47.62,88.9 52.07,88.9 52.7,88.27 57.78,88.27 69.85,100.33 69.85,104.14 U1.25
TRIAD_RX/SCL  (via drill 0.38)
  Top 0.178: J_SCL.2 17.78,46.35 U2.3 13.97,46.35 13.97,46.99 13.34,46.99 12.7,47.62 12.7,50.16 v10.16,50.16 U2.9 | v5.71,49.53 5.08,50.16 J_SCL1.2 | v55.24,58.42 55.24,86.36 52.07,89.53 J2.3
  Bottom 0.178: v5.71,49.53 9.53,49.53 v10.16,50.16 10.79,49.53 10.79,48.26 15.88,43.18 17.14,43.18 18.41,44.45 28.57,44.45 34.29,50.16 47.62,50.16 48.9,51.44 48.9,52.07 J8.4 49.53,52.7 v55.24,58.42
TRIAD_TX/SDA  (via drill 0.38)
  Top 0.178: J_SCL2.2 17.78,45.09 U2.2 13.97,45.09 12.06,46.99 12.06,48.9 v10.16,48.9 U2.10 | v5.71,46.99 6.35,47.62 6.35,48.9 5.08,48.9 J_SDA.2 | J8.3 52.07,52.07 53.98,50.16 59.05,50.16 59.05,83.82 53.98,88.9 53.98,89.53 J2.2
  Bottom 0.178: v5.71,46.99 8.26,46.99 9.53,48.26 | v10.16,48.9 9.53,48.26 | 9.53,48.26 28.57,29.21 50.8,51.44 50.8,52.07 51.44,52.7 J8.3

### Text on the board
tPlace: Optional / External EEPROM / Programmer | PASS | FAIL | PRETEST | MAIN TEST | #674 | SEN-15050 | Spectral Triad | v10 | Tap to / TEST | Board Power / and / Pretest
bPlace: GND